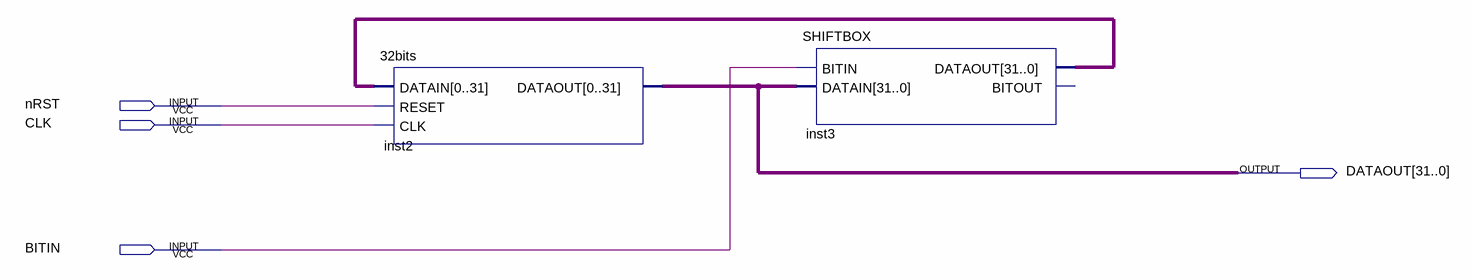
[diagram p0: schematic sheet]
// Quartus schematic REGISTRODESP32SINCARGA.bdf as structural Verilog: 2 symbols, 4 pins
module REGISTRODESP32SINCARGA (
  input  nRST,
  input  CLK,
  input  BITIN,
  output [31:0] DATAOUT
);

  wire [31:0] inst3_dataout;

  \32bits  inst2 (.DATAIN(inst3_dataout), .RESET(nRST), .CLK(CLK), .DATAOUT(DATAOUT));
  SHIFTBOX inst3 (.BITIN(BITIN), .DATAIN(DATAOUT), .DATAOUT(inst3_dataout));  // open: BITOUT
endmodule
